# Altium schematic sheet GTU-1-V1.1-20160516.SCHDOC
size A3
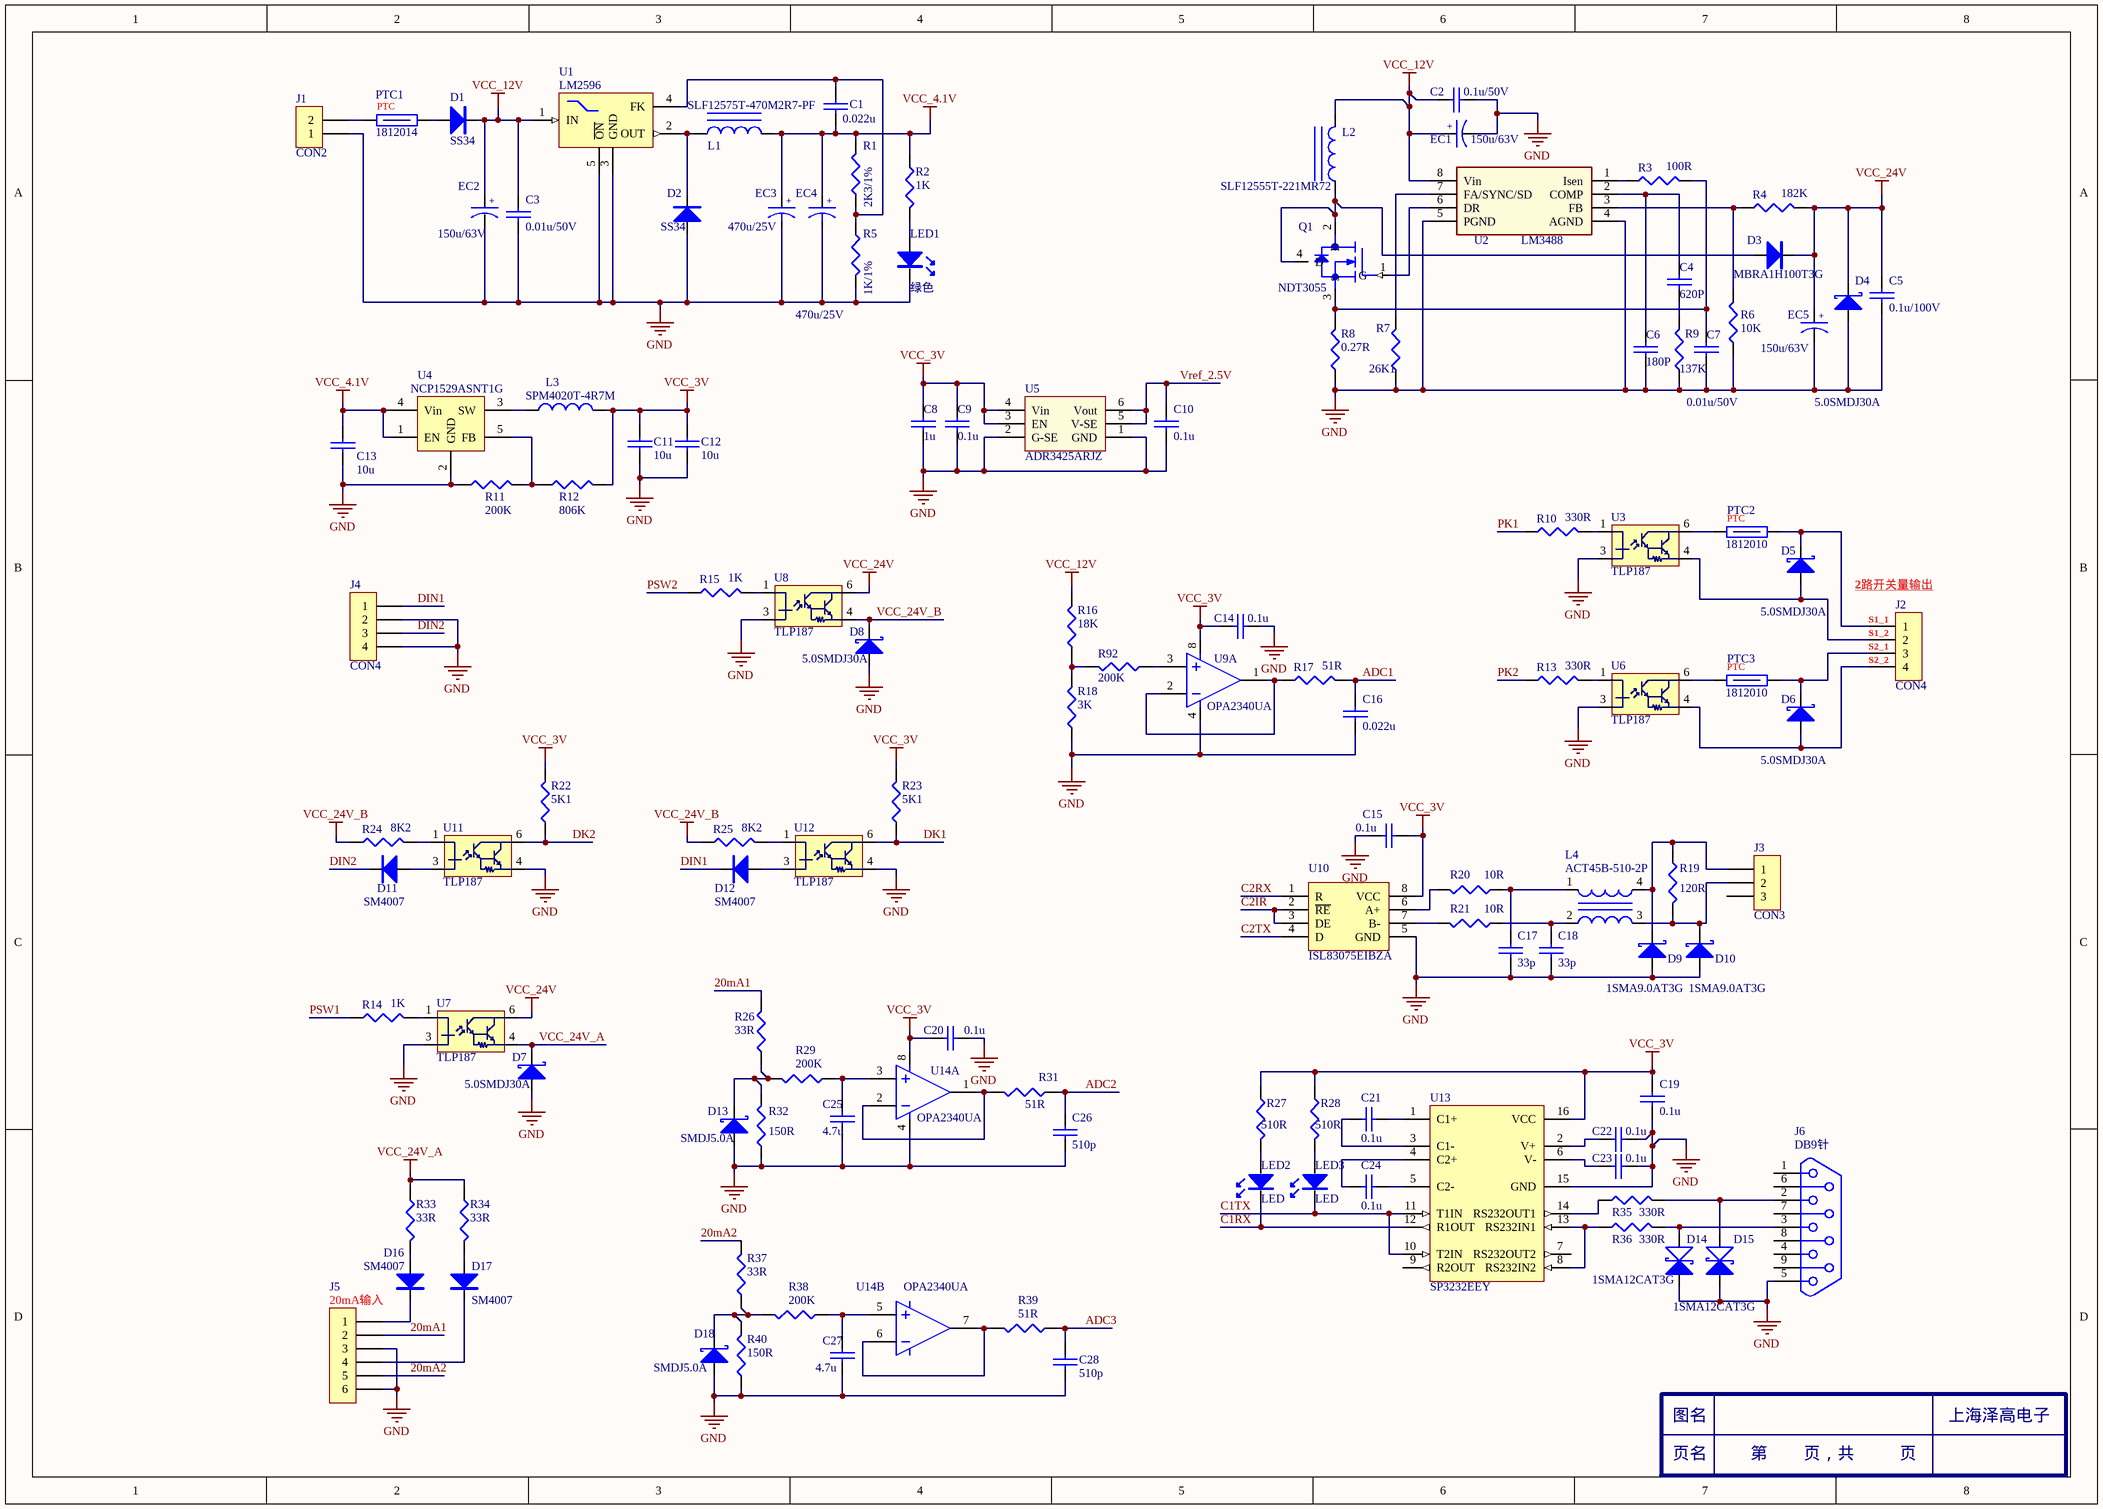
[diagram p0: GTU-1-V1.1-20160516.SCHDOC]

## Parts
3  Component_1  (value not drawn)
C1  0.022u  [0805-C]
C2  value 0.1u/50V  [0805-C]  (hidden comment: 0.1u)
C3  0.01u/50V  [0805-C]
C4  value 620P  [0805-C]  (hidden comment: 0.1u)
C5  value 0.1u/100V  [0805-C]  (hidden comment: 0.1u)
C6  value 180P  [0805-C]  (hidden comment: 0.1u)
C7  value 0.01u/50V  [0805-C]  (hidden comment: 0.1u)
C8  value 1u  [0805-C]  (hidden comment: 0.1u)
C9  0.1u  [0805-C]
C10  0.1u  [0805-C]
C11  10u  [0805-C]
C12  10u  [0805-C]
C13  10u  [0805-C]
C14  0.1u  [0805-C]
C15  0.1u  [0805-C]
C16  value 0.022u  [0805-C]  (hidden comment: 0.1u)
C17  33p  [0805-C]
C18  33p  [0805-C]
C19  0.1u  [0805-C]
C20  0.1u  [0805-C]
C21  0.1u  [0805-C]
C22  0.1u  [0805-C]
C23  0.1u  [0805-C]
C24  0.1u  [0805-C]
C25  4.7u  [0805-C]
C26  510p  [0805-C]
C27  4.7u  [0805-C]
C28  510p  [0805-C]
D1  SS34  [SMB]
D2  SS34  [SMB]
D3  MBRA1H100T3G  [SMA]
D4  5.0SMDJ30A  [SMC]
D5  5.0SMDJ30A  [SMC]
D6  5.0SMDJ30A  [SMC]
D7  5.0SMDJ30A  [SMC]
D8  5.0SMDJ30A  [SMC]
D9  MFG_PN: 1SMA9.0AT3G  [SMA]  (hidden comment: 1SMAxxAT3G)
D10  MFG_PN: 1SMA9.0AT3G  [SMA]  (hidden comment: 1SMAxxAT3G)
D11  SM4007  [SMA]
D12  SM4007  [SMA]
D13  SMDJ5.0A  [SMC]
D14  MFG-PN: 1SMA12CAT3G  [SMA]  (hidden comment: 1SMAxxCAT3G)
D15  1SMA12CAT3G  [SMA]
D16  SM4007  [SMA]
D17  SM4007  [SMA]
D18  SMDJ5.0A  [SMC]
EC1  150u/63V  [SMD10X10.5]
EC2  value 150u/63V  [SMD10X10.5]  (hidden comment: CAP Al)
EC3  470u/25V  [SMD10X10.5]
EC4  470u/25V  [SMD10X10.5]
EC5  150u/63V  [SMD10X10.5]
J1  CON2  [15EDGRC-3.81-2P]
J2  CON4  [15EDGRC-3.81-4P]
J3  CON3  [15EDGRC-3.81-3P]
J4  CON4  [15EDGRC-3.81-4P]
J5  20mA输入  [15EDGRC-3.81-6P]
J6  DB9针  [DB9RA/M]
L1  SLF12575T-470M2R7-PF  [SLF12575]
L2  SLF12555T-221MR72  [SLF12575]
L3  SPM4020T-4R7M  [SPM4020T-4R7M]
L4  ACT45B-510-2P  [ACT45B]
LED1  绿色  [0805-LED]
LED2  LED  [0805-LED]
LED3  LED  [0805-LED]
PTC1  1812014  [1812l075]
PTC2  1812010  [1812l075]
PTC3  1812010  [1812l075]
Q1  NDT3055  [SOT-223]
R1  2K3/1%  [0805-R]
R2  1K  [0805-R]
R3  value 100R  [0805-R]  (hidden comment: RES)
R4  value 182K  [0805-R]  (hidden comment: RES)
R5  1K/1%  [0805-R]
R6  value 10K  [0805-R]  (hidden comment: RES)
R7  value 26K1  [0805-R]  (hidden comment: RES)
R8  value 0.27R  [0805-R]  (hidden comment: RES)
R9  value 137K  [0805-R]  (hidden comment: RES)
R10  value 330R  [0805-R]  (hidden comment: RES)
R11  200K  [0805-R]
R12  806K  [0805-R]
R13  value 330R  [0805-R]  (hidden comment: RES)
R14  value 1K  [0805-R]  (hidden comment: RES)
R15  value 1K  [0805-R]  (hidden comment: RES)
R16  value 18K  [0805-R]  (hidden comment: RES)
R17  value 51R  [0805-R]  (hidden comment: RES)
R18  value 3K  [0805-R]  (hidden comment: RES)
R19  120R  [1210-R]
R20  10R  [0805-R]
R21  10R  [0805-R]
R22  value 5K1  [0805-R]  (hidden comment: RES)
R23  value 5K1  [0805-R]  (hidden comment: RES)
R24  value 8K2  [0805-R]  (hidden comment: RES)
R25  value 8K2  [0805-R]  (hidden comment: RES)
R26  33R  [1210-R]
R27  value 510R  [0805-R]  (hidden comment: RES)
R28  value 510R  [0805-R]  (hidden comment: RES)
R29  200K  [0805-R]
R31  51R  [0805-R]
R32  150R  [1210-R]
R33  33R  [1210-R]
R34  33R  [1210-R]
R35  value 330R  [0805-R]  (hidden comment: RES)
R36  value 330R  [0805-R]  (hidden comment: RES)
R37  33R  [1210-R]
R38  200K  [0805-R]
R39  51R  [0805-R]
R40  150R  [1210-R]
R92  value 200K  [0805-R]  (hidden comment: RES)
U1  LM2596  [D2PAK-5]
U2  LM3488  [MSOP-8]
U3  TLP187  [TLP187]
U4  NCP1529ASNT1G  [SOT-23-5]
U5  ADR3425ARJZ  [SOT-23-6]
U6  TLP187  [TLP187]
U7  TLP187  [TLP187]
U8  TLP187  [TLP187]
U9  OPA2340UA  [SO-8]  (part A of 2)
U10  ISL83075EIBZA  [SO-8]
U11  TLP187  [TLP187]
U12  TLP187  [TLP187]
U13  SP3232EEY  [TSSOP-16]
U14  OPA2340UA  [SO-8]  (parts A,B of 2)

## Nets
GND: C2.2 C3.2 C5.2 C6.2 C7.2 C8.2 C9.2 C10.2 C11.2 C12.2 C13.2 C14.2 C15.2 C16.2 C17.2 C18.2 C19.1 C20.2 C22.1 C23.1 C25.2 C26.2 C27.2 C28.2 D2.A D4.A D7.A D8.A D9.A D10.A D13.A D14.A D15.A D18.A EC1.2 EC2.2 EC3.2 EC4.2 EC5.2 J1.1 J4.2 J4.4 J5.3 J5.6 J6.5 LED1.2 R5.2 R6.1 R7.1 R8.1 R9.1 R11.1 R18.1 R32.1 R40.1 U1.3(GND) U1.5(~{ON}) U2.4(AGND) U2.5(PGND) U3.3 U4.2(GND) U5.1(GND) U5.2(G-SE) U6.3 U7.3 U8.3 U9.4 U10.5(GND) U11.4 U12.4 U13.15(GND) U14.4
VCC_3V: C8.1 C9.1 C11.1 C12.1 C14.1 C15.1 C19.2 C20.1 L3.2 R12.2 R22.2 R23.2 R27.2 R28.2 U5.3(EN) U5.4(Vin) U9.8 U10.8(VCC) U13.16(VCC) U14.8
VCC_4.1V: C1.1 C13.1 EC3.1 EC4.1 L1.2 R1.2 R2.1 U4.1(EN) U4.4(Vin)
VCC_12V: C2.1 C3.1 D1.K EC1.1 EC2.1 L2.2 R16.2 U1.1(IN) U2.8(Vin)
VCC_24V: C5.1 D3.K D4.K EC5.1 R4.2 U7.6 U8.6
VCC_24V_A: D7.K R33.1 R34.1 U7.4
VCC_24V_B: D8.K R24.1 R25.1 U8.4
20mA1: J5.2 R26.2
20mA2: J5.5 R37.2
ADC1: C16.1 R17.2
ADC2: C26.1 R31.1
ADC3: C28.1 R39.1
C1RX: LED2.2 U13.12(R1OUT)
C1TX: LED3.2 U13.10(T2IN) U13.11(T1IN)
C2IR: U10.2(~{RE}) U10.3(DE)
C2RX: U10.1(R)
C2TX: U10.4(D)
DIN1: D12.K J4.1
DIN2: D11.K J4.3
DK1: R23.1 U12.6
DK2: R22.1 U11.6
PK1: R10.1
PK2: R13.1
PSW1: R14.1
PSW2: R15.1
Vref_2.5V: C10.1 U5.5(V-SE) U5.6(Vout)
NetC1_2: C1.2 R1.1 R5.1 U1.4(FK)
NetC4_1: C4.1 C6.1 U2.2(COMP)
NetC4_2: C4.2 R9.2
NetC7_1: C7.1 Q1.3(S) R3.2 R8.2
NetC17_1: C17.1 L4.1 R20.1
NetC18_1: C18.1 L4.2 R21.1
NetC21_1: C21.1 U13.1(C1+)
NetC21_2: C21.2 U13.3(C1-)
NetC22_2: C22.2 U13.2(V+)
NetC23_2: C23.2 U13.6(V-)
NetC24_1: C24.1 U13.5(C2-)
NetC24_2: C24.2 U13.4(C2+)
NetC25_1: C25.1 R29.1 U14.3
NetC27_1: C27.1 R38.1 U14.5
NetD1_A: D1.A PTC1.2
NetD2_K: D2.K L1.1 U1.2(OUT)
NetD3_A: D3.A L2.1 Q1.2(D) Q1.4(D)
NetD5_A: D5.A J2.2 U3.4
NetD5_K: D5.K J2.1 PTC2.2
NetD6_A: D6.A J2.4 U6.4
NetD6_K: D6.K J2.3 PTC3.2
NetD9_K: D9.K J3.1 L4.4 R19.1
NetD10_K: D10.K J3.2 L4.3 R19.2
NetD11_A: D11.A U11.3
NetD12_A: D12.A U12.3
NetD13_K: D13.K R26.1 R29.2 R32.2
NetD14_K: D14.K J6.3 R36.1
NetD15_K: D15.K J6.2 R35.1
NetD16_A: D16.A R33.2
NetD16_K: D16.K J5.1
NetD17_A: D17.A R34.2
NetD17_K: D17.K J5.4
NetD18_K: D18.K R37.1 R38.2 R40.2
NetJ1_2: J1.2 PTC1.1
NetL3_1: L3.1 U4.3(SW)
NetLED1_1: LED1.1 R2.2
NetLED2_1: LED2.1 R27.1
NetLED3_1: LED3.1 R28.1
NetPTC2_1: PTC2.1 U3.6
NetPTC3_1: PTC3.1 U6.6
NetQ1_1: Q1.1(G) U2.6(DR)
NetR3_1: R3.1 U2.1(Isen)
NetR4_1: R4.1 R6.2 U2.3(FB)
NetR7_2: R7.2 U2.7(FA/SYNC/SD)
NetR10_2: R10.2 U3.1
NetR11_2: R11.2 R12.1 U4.5(FB)
NetR13_2: R13.2 U6.1
NetR14_2: R14.2 U7.1
NetR15_2: R15.2 U8.1
NetR16_1: R16.1 R18.2 R92.2
NetR17_1: R17.1 U9.1 U9.2
NetR20_2: R20.2 U10.6(A+)
NetR21_2: R21.2 U10.7(B-)
NetR24_2: R24.2 U11.1
NetR25_2: R25.2 U12.1
NetR31_2: R31.2 U14.1 U14.2
NetR35_2: R35.2 U13.14(RS232OUT1)
NetR36_2: R36.2 U13.8(RS232IN2) U13.13(RS232IN1)
NetR39_2: R39.2 U14.6 U14.7
NetR92_1: R92.1 U9.3

Not connected (* = marked no-connect by the designer): J3 3; J6 1 4 6 7 8 9; U13 7(RS232OUT2) 9(R2OUT)

## Notes on the sheet
- 2路开关量输出
- (near J2) S1_1
- (near J2) S1_2
- (near J2) S2_1
- (near J2) S2_2
- (in symbol BK30-500) PTC
- (in symbol CAP Al) +
- (in symbol Component_1) 图名; 上海泽高电子; 页名; 第        页，共          页

## Library data of the parts
C1 C3 C11-C13 C15 C17 C18 C20 C25-C28 = CAP: Capacitor
C2 C4-C10 C14 C16 C19 C21-C24 = CAP: Capacitor; MFG: TDK; status: APPROVED
  C9 C10 C14 C19 C21-C24: value: 0.1u
D1 D2 D11 D12 D16 D17 = DIODE
D3 = 1N4148: 100V 70mA开关二极管; MFG: Verical; STATUS2: APPROVED; Datasheet: 1N4148  100V 70mA开关二极管; MFG2: FAIRCHILD; MFG-PN: 1N4148; MFG2-PN: 1N4148; STATUS: APPROVED
D4-D8 = 5.0SMDJxxA: bidirectional  5000W TVS; MFG: Littelfuse; STATUE: APPROVED; Value: 5.0SMDJ13A; Value: 5.0SMDJ14A; Value: 5.0SMDJ15A; Value: 5.0SMDJ16A; Value: 5.0SMDJ17A; Value: 5.0SMDJ18A; Value: 5.0SMDJ20A; Value: 5.0SMDJ22A; Value: 5.0SMDJ24A; Value: 5.0SMDJ26A; Value: 5.0SMDJ28A; Value: 5.0SMDJ33A; Value: 5.0SMDJ36A; Value: 5.0SMDJ40A; Value: 5.0SMDJ43A; Value: 5.0SMDJ45A; Value: 5.0SMDJ48A; Value: 5.0SMDJ51A; Value: 5.0SMDJ54A; Value: 5.0SMDJ58A; Value: 5.0SMDJ60A; Value: 5.0SMDJ64A; Value: 5.0SMDJ70A; Value: 5.0SMDJ75A; Value: 5.0SMDJ78A; Value: 5.0SMDJ85A; Value: 5.0SMDJ90A; Value: 5.0SMDJ100A; Value: 5.0SMDJ110A; Value: 5.0SMDJ120A; Value: 5.0SMDJ130A; Value: 5.0SMDJ150A; Value: 5.0SMDJ160A; Value: 5.0SMDJ170A; Value: 5.0SMDJ12A; Datasheet: 5.0SMDJ12A    5000W单向TVS; Value: 5.0SMDJ30A; Description: bidirectional 5000W TVS
D9 D10 = 1SMAxxAT3G: Unidirectional 400W TVS; MFG: ON-SEMI; MFG_PN: 1SMA5.0AT3G; MFG_PN: 1SMA6.0AT3G; MFG_PN: 1SMA6.5AT3G; MFG_PN: 1SMA8.0AT3G; MFG_PN: 1SMA8.5AT3G; MFG_PN: 1SMA10AT3G; MFG_PN: 1SMA11AT3G; MFG_PN: 1SMA12AT3G; MFG_PN: 1SMA13AT3G; MFG_PN: 1SMA14AT3G; MFG_PN: 1SMA15AT3G; MFG_PN: 1SMA16AT3G; MFG_PN: 1SMA17AT3G; MFG_PN: 1SMA18AT3G; MFG_PN: 1SMA20AT3G; MFG_PN: 1SMA22AT3G; MFG_PN: 1SMA24AT3G; MFG_PN: 1SMA26AT3G; MFG_PN: 1SMA28AT3G; MFG_PN: 1SMA30AT3G; MFG_PN: 1SMA33AT3G; MFG_PN: 1SMA36AT3G; MFG_PN: 1SMA40AT3G; MFG_PN: 1SMA43AT3G; MFG_PN: 1SMA45AT3G; MFG_PN: 1SMA48AT3G; MFG_PN: 1SMA54AT3G; MFG_PN: 1SMA58AT3G; MFG_PN: 1SMA70AT3G; MFG_PN: 1SMA75AT3G; MFG_PN: 1SMAXXAT3G; Price: 0.92; DataSheet: 1SMAXXAT3G  400W单向TVS; STATUS: APPROVED
D13 D18 = TVS
D14 D15 = 1SMAxxCAT3G: 400W双向TVS  ON Semconductor; MFG: ON SEMI; STATUE: APPROVED; MFG-PN: 1SMA10CAT3G; MFG-PN: 1SMA11CAT3G; MFG-PN: 1SMA13CAT3G; MFG-PN: 1SMA14CAT3G; MFG-PN: 1SMA15CAT3G; MFG-PN: 1SMA16CAT3G; MFG-PN: 1SMA18CAT3G; MFG-PN: 1SMA20CAT3G; MFG-PN: 1SMA24CAT3G; MFG-PN: 1SMA26CAT3G; MFG-PN: 1SMA28CAT3G; MFG-PN: 1SMA30CAT3G; MFG-PN: 1SMA33CAT3G; MFG-PN: 1SMA36CAT3G; MFG-PN: 1SMA40CAT3G; MFG-PN: 1SMA48CAT3G; MFG-PN: 1SMA51CAT3G; MFG-PN: 1SMA58CAT3G; MFG-PN: 1SMA60CAT3G; MFG-PN: 1SMA70CAT3G; MFG-PN: 1SMA78CAT3G; Datasheet: 1SMAXXCAT3G     400W双向TVS; MFG-PN: 1SMAxxCAT3G
  D15: MFG-PN: 1SMA12CAT3G
EC1 EC2 EC5 = CAP Al: 铝电解电容; MFG: RUBYCON; datasheet: RUBYCON 贴片铝电解电容; status: APPROVED
  EC1 EC5: value: 150u/63V
EC3 EC4 = CAP Al
J1 = CON2: Connector
J2 J4 = CON4: Connector
J3 = CON3: Connector
J5 = CON6: Connector
J6 = DB9
L1 = INDUCTOR IRON: 型号: SLF12575T-470M2R7-PF
L2 = SLF12575: 12.5X12.5X7.5mm屏蔽功率电感; MFG: TDK; statues: APPROVED; VALUE: SLF12575T-330M3R2-PF; VALUE: SLF12575T-220M4R0-PF; VALUE: SLF12575T-101M1R9-PF; VALUE: SLF12575T-221M1R3-PF; VALUE: SLF12575T-151M1R5-PF; VALUE: SLF12575T-680M2R0-PF; VALUE: SLF12575T-470M2R7-PF; datasheet: RLF12560T     TDK功率电感
L3 = INDUCTOR
LED1 = LED
PTC1-PTC3 = BK30-500: 自恢复熔丝; MFG: 君耀; MFG-PN: BK30-500; datasheet: BK30-500   自恢复熔丝; status: APPROVED; value: BK30-500
Q1 = NDT3055: 2A 60V NMOS; STATUS2: APPROVED; MFG2_PN: IRFL014PBF; MFG: FAIRCHILD; Description: TRANS CAN-N SOT223 2A 60V CMS; MFG2: VISHAY SEMI; STATUS1: APPROVED; MFG_PN: NDT3055
R1 R2 R5 R11 R12 R19-R21 R26 R29 R31-R34 R37-R40 = RES
R3 R4 R6-R10 R13-R18 R22-R25 R27 R28 R35 R36 R92 = RES: 电阻; MFG: YAGO; tatus: APPROVED; datasheet: YAGO国巨  贴片电阻手册2011版
U1 = LM2596DSADJR4G
U2 = LM3488MM NOPB: ANALOG LM3488MM CMS; MFG: NATIONAL SEMI; STATUS1: APPROVED; Last_Update: 2013-1-9; MFG_PN: LM3488MM NOPB; DataSheet1: #D:\cc_native\Hardware_Resource\硬件重用库\CIS库\DataSheet\IC\U1301-080-06_LM3488MM.pdf#
U3 U6-U8 U11 U12 = TLP187: Darlington Photocouple Trsnsistor; MFG: TOSHIBA; MG-PN: TLP187
U5 = ADR3430ARJZ
U9 U14 = OPA2340: 双运放; statues: APPROVED; MFG: TI; Description: microPower, Rail-to-Rail  2 Operational Amplifiers; MFG-PN: OPA2340UA
U10 = 75LBC184
U13 = SP3232EEA: +3.3V 1Mbps RS232收发器 SIPEX; datasheet: SP3222EEA   +3.3V RS232收发器; MFG: SIPEX; MFG-PN: SP3232EEA; status: APPROVED; value: SP3232EEA